# EAGLE design generic_micro_1 (EAGLE 6.4)
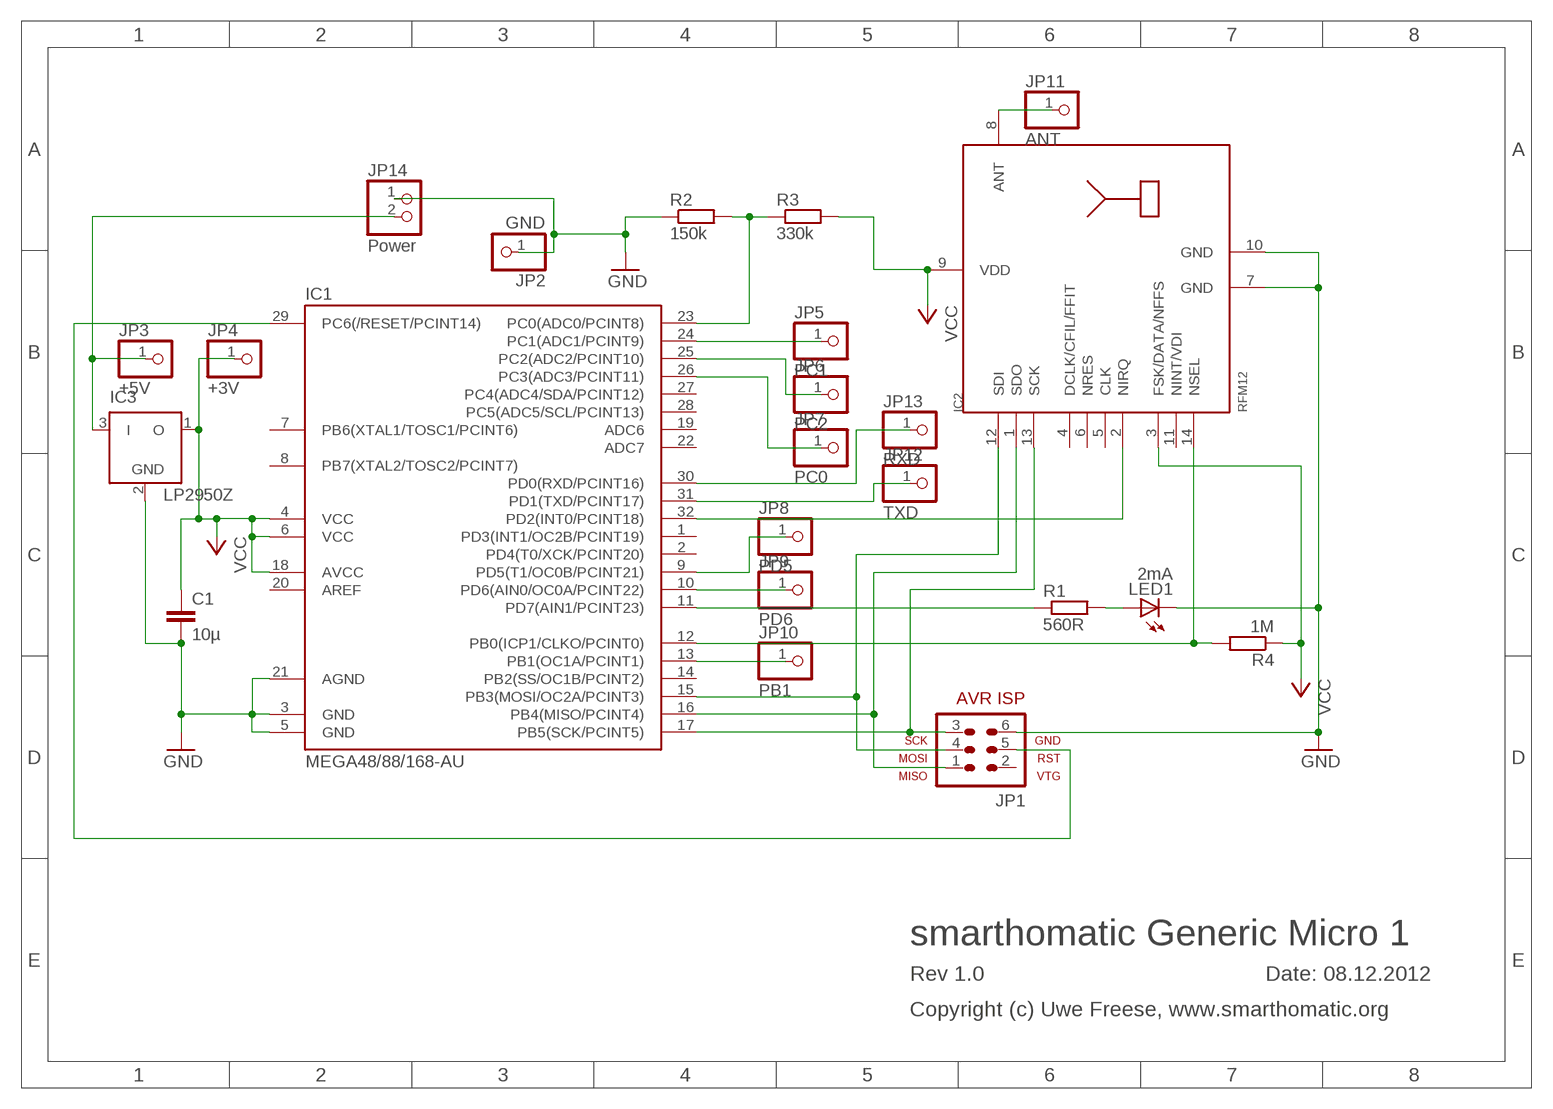
[diagram p0: schematic, sheet 1]

## Parts
C1  10µ  C-EUC0805  [C0805]
IC1  MEGA48/88/168-AU  [TQFP32-08]
IC2  RFM12  [RFM]
IC3  LP2950Z  [TO92]
JP1  AVR-ISP-6  [AVR-ISP-6]
JP2  GND  PINHD-1X1  [1X01]
JP3  +5V  PINHD-1X1  [1X01]
JP4  +3V  PINHD-1X1  [1X01]
JP5  PC1  PINHD-1X1  [1X01]
JP6  PC2  PINHD-1X1  [1X01]
JP7  PC0  PINHD-1X1  [1X01]
JP8  PD5  PINHD-1X1  [1X01]
JP9  PD6  PINHD-1X1  [1X01]
JP10  PB1  PINHD-1X1  [1X01]
JP11  ANT  PINHD-1X1  [1X01]
JP12  TXD  PINHD-1X1  [1X01]
JP13  RXD  PINHD-1X1  [1X01]
JP14  Power  PINHD-1X2  [1X02]
LED1  2mA  LED3MM  [LED3MM]
R1  560R  R-EU_R0603  [R0603]
R2  150k  R-EU_R0603  [R0603]
R3  330k  R-EU_R0603  [R0603]
R4  1M  R-EU_R0603  [R0603]

## Nets
GND: C1.2 IC1.3(GND) IC1.5(GND) IC1.21(AGND) IC2.7(GND) IC2.10(GND) IC3.2(GND) JP1.6 JP2.1 JP14.1 LED1.K(C) R2.1
N$1: IC1.26(PC3(ADC3/PCINT11)) JP7.1
N$2: IC1.24(PC1(ADC1/PCINT9)) JP5.1
N$3: IC1.15(PB3(MOSI/OC2A/PCINT3)) IC2.12(SDI) JP1.4
N$4: IC1.16(PB4(MISO/PCINT4)) IC2.1(SDO) JP1.1
N$5: IC1.17(PB5(SCK/PCINT5)) IC2.13(SCK) JP1.3
N$6: IC1.11(PD7(AIN1/PCINT23)) R1.1
N$7: IC1.25(PC2(ADC2/PCINT10)) JP6.1
N$8: IC1.29(PC6(/RESET/PCINT14)) JP1.5
N$9: IC1.10(PD6(AIN0/OC0A/PCINT22)) JP9.1
N$10: IC1.9(PD5(T1/OC0B/PCINT21)) JP8.1
N$11: IC1.13(PB1(OC1A/PCINT1)) JP10.1
N$12: LED1.A R1.2
N$13: IC1.12(PB0(ICP1/CLKO/PCINT0)) IC2.14(NSEL) R4.2
N$14: IC1.23(PC0(ADC0/PCINT8)) R2.2 R3.1
N$15: IC1.32(PD2(INT0/PCINT18)) IC2.2(NIRQ)
N$16: IC2.8(ANT) JP11.1
N$17: IC3.3(I) JP3.1 JP14.2
N$18: IC1.31(PD1(TXD/PCINT17)) JP12.1
N$19: IC1.30(PD0(RXD/PCINT16)) JP13.1
VCC: C1.1 IC1.4(VCC) IC1.6(VCC) IC1.18(AVCC) IC2.3(FSK/DATA/NFFS) IC2.9(VDD) IC3.1(O) JP4.1 R3.2 R4.1
Unconnected: IC1.1(PD3(INT1/OC2B/PCINT19)) IC1.2(PD4(T0/XCK/PCINT20)) IC1.7(PB6(XTAL1/TOSC1/PCINT6)) IC1.8(PB7(XTAL2/TOSC2/PCINT7)) IC1.14(PB2(SS/OC1B/PCINT2)) IC1.19(ADC6) IC1.20(AREF) IC1.22(ADC7) IC1.27(PC4(ADC4/SDA/PCINT12)) IC1.28(PC5(ADC5/SCL/PCINT13)) IC2.4(DCLK/CFIL/FFIT) IC2.5(CLK) IC2.6(NRES) IC2.11(NINT/VDI) JP1.2

## Notes on the sheet
- smarthomatic Generic Micro 1
- Rev 1.0 | Date: 08.12.2012
- Copyright (c) Uwe Freese, www.smarthomatic.org

## Library data of the parts
C1 = rcl:C-EU: CAPACITOR, European symbol
IC1 = avr-5-4.16:MEGA48/88/168
IC2 = hopeRF:RFM12
IC3 = linear:LP2950: 100 mA, Low Power Low Dropout Voltage Regulator Source: http://www.onsemi.com/pub/Collateral/LP2950-D.PDF
JP1 = avr-5-4.16:AVR-ISP-6: AVR ISP-6 Serial Programming Header
JP2-JP13 = pinhead:PINHD-1X1: PIN HEADER
JP14 = pinhead:PINHD-1X2: PIN HEADER
LED1 = led:LED: LED OSRAM: - CHIPLED LG R971, LG N971, LY N971, LG Q971, LY Q971, LO R971, LY R971 LH N974, LH R974 LS Q976, LO Q976, LY Q976 LO Q996 - Hyper CHIPLED LW Q18S LB Q993, LB Q99A, LB R99A - SideLED LS A670, LO A670, LY A670, LG A670, LP A670 LB A673, LV A673, LT A673, LW A673 LH A674 LY A675 LS A676, LA A676, LO A676, LY A676, LW A676 LS A679, LY A679, LG A679 - Hyper Micro SIDELED® LS Y876, LA Y876, LO Y876, LY Y876 LT Y87S - SmartLED LW L88C, LW L88S LB L89C, LB L89S, LG L890 LS L89K, LO L89K, LY L89K LS L896, LA L896, LO L896, LY L896 - TOPLED LS T670, LO T670, LY T670, LG T670, LP T670 LSG T670, LSP T670, LSY T670, LOP T670, LYG T670 LG T671, LOG T671, LSG T671 LB T673, LV T673, LT T673, LW T673 LH T674 LS T676, LA T676, LO T676, LY T676, LB T676, LH T676, LSB T676, LW T676 LB T67C, LV T67C, LT T67C, LS T67K, LO T67K, LY T67K, LW E67C LS E67B, LA E67B, LO E67B, LY E67B, LB E67C, LV E67C, LT E67C LW T67C LS T679, LY T679, LG T679 LS T770, LO T770, LY T770, LG T770, LP T770 LB T773, LV T773, LT T773, LW T773 LH T774 LS E675, LA E675, LY E675, LS T675 LS T776, LA T776, LO T776, LY T776, LB T776 LHGB T686 LT T68C, LB T68C - Hyper Mini TOPLED® LB M676 - Mini TOPLED Santana® LG M470 LS M47K, LO M47K, LY M47K Source: http://www.osram.convergy.de LUXEON: - LUMILED® LXK2-PW12-R00, LXK2-PW12-S00, LXK2-PW14-U00, LXK2-PW14-V00 LXK2-PM12-R00, LXK2-PM12-S00, LXK2-PM14-U00 LXK2-PE12-Q00, LXK2-PE12-R00, LXK2-PE12-S00, LXK2-PE14-T00, LXK2-PE14-U00 LXK2-PB12-K00, LXK2-PB12-L00, LXK2-PB12-M00, LXK2-PB14-N00, LXK2-PB14-P00, LXK2-PB14-Q00 LXK2-PR12-L00, LXK2-PR12-M00, LXK2-PR14-Q00, LXK2-PR14-R00 LXK2-PD12-Q00, LXK2-PD12-R00, LXK2-PD12-S00 LXK2-PH12-R00, LXK2-PH12-S00 LXK2-PL12-P00, LXK2-PL12-Q00, LXK2-PL12-R00 Source: www.luxeon.com KINGBRIGHT: KA-3528ASYC Source: www.kingbright.com
R1-R4 = rcl:R-EU_: RESISTOR, European symbol

## Board
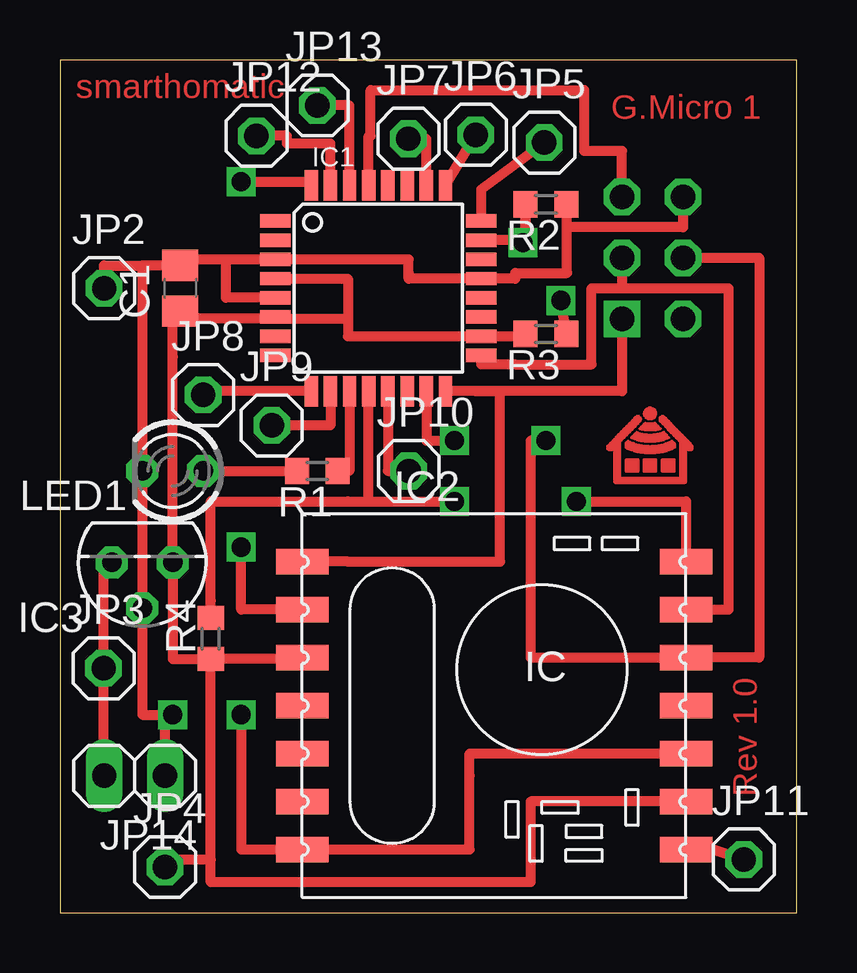
[diagram p1: board, top side]
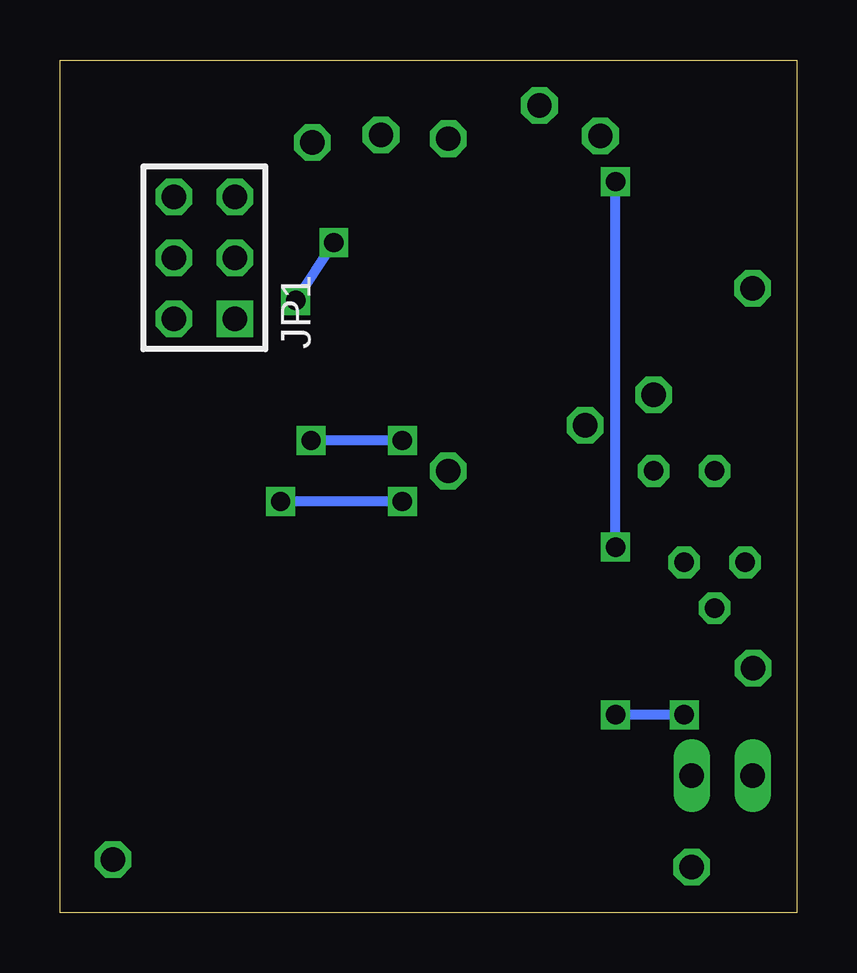
[diagram p2: board, bottom side, seen from below]

Size 30.72 x 35.55 mm. Coordinates in mm from the lower left corner, seen from the top.
Outline: 0,0 30.72,0 30.72,35.55 0,35.55 0,0
Copper layers (1*16): Top 0.035mm / dielectric 1.5mm / Bottom 0.035mm
Design rules "default": minimum track width 10mil, minimum drill 24mil, track to track 8mil, track to pad 8mil, pad to pad 8mil, via to via 8mil, smd to smd 8mil, copper to edge 40mil, drill to drill 8mil, minimum pad ring 10mil, minimum via ring 8mil, stop-mask expansion 4mil, vias tented up to drill 0mil, thermal gap 10mil

### Footprints (pad centres in the part's own frame; a part is rotated, then mirrored left to right if it is on the bottom)
C0805 = smd 1.3 x 1.5: 1 -0.95,0; 2 0.95,0
TQFP32-08 = smd 1.27 x 0.559: 1 -4.293,2.8; 2 -4.293,2; 3 -4.293,1.2; 4 -4.293,0.4; 5 -4.293,-0.4; 6 -4.293,-1.2; 7 -4.293,-2; 8 -4.293,-2.8; 17 4.293,-2.8; 18 4.293,-2; 19 4.293,-1.2; 20 4.293,-0.4; 21 4.293,0.4; 22 4.293,1.2; 23 4.293,2; 24 4.293,2.8 | smd 0.559 x 1.27: 9 -2.8,-4.293; 10 -2,-4.293; 11 -1.2,-4.293; 12 -0.4,-4.293; 13 0.4,-4.293; 14 1.2,-4.293; 15 2,-4.293; 16 2.8,-4.293; 25 2.8,4.293; 26 2,4.293; 27 1.2,4.293; 28 0.4,4.293; 29 -0.4,4.293; 30 -1.2,4.293; 31 -2,4.293; 32 -2.8,4.293
RFM = smd 2.184 x 1.067: 1 0,14; 2 0,12; 3 0,10; 4 0,8; 5 0,6; 6 0,4; 7 0,2; 8 16,2; 9 16,4; 10 16,6; 11 16,8; 12 16,10; 13 16,12; 14 16,14
TO92 = drill 0.813 octagon: 1 -1.27,0; 2 0,1.905; 3 1.27,0
AVR-ISP-6 = drill 1.016 square: 1 -2.54,-1.27 | drill 1.016 octagon: 2 -2.54,1.27; 3 0,-1.27; 4 0,1.27; 5 2.54,-1.27; 6 2.54,1.27
1X01 = drill 1.016 octagon: 1 0,0
1X02 = drill 1.016 long: 1 -1.27,0; 2 1.27,0
LED3MM = drill 0.813 octagon: A -1.27,0; K 1.27,0
R0603 = smd 1 x 1.1: 1 -0.85,0; 2 0.85,0

### Placement (x,y rotation side)
C1  5.02,26.04 90 top
IC1  13.27,26.04 0 top
IC2  10.1,0.64 0 top
IC3  3.43,14.61 180 top
JP1  24.7,27.31 90 bottom
JP2  1.84,26.04 0 top
JP3  1.82,10.19 0 top
JP4  4.38,1.91 0 top
JP5  20.19,32.11 0 top
JP6  17.34,32.43 0 top
JP7  14.53,32.27 0 top
JP8  5.97,21.59 0 top
JP9  8.83,20.32 0 top
JP10  14.54,18.42 0 top
JP11  28.51,2.22 0 top
JP12  8.19,32.39 0 top
JP13  10.73,33.66 0 top
JP14  3.11,5.71 180 top
LED1  4.7,18.42 180 top
R1  10.73,18.42 180 top
R2  20.26,29.53 180 top
R3  20.26,24.13 180 top
R4  6.29,11.43 90 top

### Tracks (layer width: path | path; a pad name or v marks a point on that pad's centre or on a via)
GND  (via drill 0.8)
  Top 0.406: IC2.10 17.08,6.64 17.08,5.71 17.08,2.64 IC2.7 7.56,2.64 v7.56,8.25 | IC3.2 LED1.K 3.43,25.64 3.43,26.99 | IC3.2 3.43,12.07 | 3.43,12.07 3.43,8.25 v4.7,8.25 4.38,8.25 JP14.1 | C1.2 3.43,26.99 | C1.2 4.97,26.99 | 6.92,27.24 IC1.3 14.54,27.24 14.54,26.67 14.54,26.43 IC1.21 18.99,26.43 18.99,26.67 21.15,26.67 21.15,28.57 | 6.92,27.24 5.02,27.24 C1.2 | IC1.5 6.92,25.64 6.92,27.24 | R2.1 21.15,29.53 21.15,28.57 | IC3.2 3.43,12.07 | JP1.6 25.97,28.57 21.15,28.57 | JP2.1 1.84,26.99 3.43,26.99
  Bottom 0.406: v4.7,8.25 v7.56,8.25
N$1
  Top 0.406: IC1.26 15.27,32.27 JP7.1
N$2
  Top 0.406: IC1.24 17.56,30.16 JP5.1
N$3  (via drill 0.8)
  Top 0.406: IC1.15 15.27,19.68 v16.45,19.68 | v20.26,19.68 19.62,19.68 19.62,18.42 19.62,10.64 IC2.12 29.15,10.64 29.15,27.31 JP1.4
  Bottom 0.406: v16.45,19.68 v20.26,19.68
N$4
  Top 0.406: 18.35,21.74 17.34,21.74 | 17.34,21.74 18.35,21.74 | 18.35,21.74 IC1.16 | IC2.1 12,14.64 18.35,14.64 18.35,21.74 | 17.34,21.74 18.35,21.74 | JP1.1 23.43,21.74 18.35,21.74
N$5
  Top 0.406: IC2.13 27.88,12.64 27.88,26.04 23.43,26.04 | IC1.17 17.56,22.86 18.99,22.86 22.16,22.86 22.16,26.04 23.43,26.04 | JP1.3 23.43,26.04
N$6
  Top 0.406: IC1.11 12.07,18.42 R1.1
N$7
  Top 0.406: IC1.25 JP6.1
N$8
  Top 0.406: IC1.29 12.87,32.39 12.95,32.39 12.95,34.29 21.84,34.29 21.84,31.75 23.43,31.75 JP1.5
N$9
  Top 0.406: IC1.10 11.27,20.32 JP9.1
N$10
  Top 0.406: IC1.9 5.97,21.74 JP8.1
N$11
  Top 0.406: IC1.13 13.67,18.42 JP10.1
N$12
  Top 0.406: LED1.A R1.2
N$13  (via drill 0.8)
  Top 0.406: R4.2 6.29,13.02 6.29,17.14 12,17.14 12.87,17.14 | 12.87,17.14 IC1.12 | 12.87,17.14 v16.45,17.14 | v21.53,17.14 26.1,17.14 IC2.14
  Bottom 0.406: v16.45,17.14 v21.53,17.14
N$14  (via drill 0.8)
  Top 0.406: 19.41,28.57 R2.2 19.41,28.57 | 19.41,28.57 19.41,28.04 IC1.23 | R3.1 v20.89,25.53 | v19.3,27.94 19.41,28.57
  Bottom 0.406: v20.89,25.53 v19.3,27.94
N$15  (via drill 0.8)
  Top 0.406: 10.47,30.48 IC1.32 10.47,30.48 | IC2.2 7.56,12.64 v7.56,15.24 | v7.56,30.48 10.47,30.48
  Bottom 0.406: v7.56,15.24 v7.56,30.48
N$16
  Top 0.406: IC2.8 27.24,2.64 JP11.1
N$17
  Top 0.406: IC3.3 1.82,14.61 JP3.1 1.82,5.73 arc90 JP14.2
N$18
  Top 0.406: IC1.31 11.27,32.07 9.46,32.07 9.46,32.39 JP12.1
N$19
  Top 0.406: IC1.30 12.07,33.66 JP13.1
VCC
  Top 0.406: IC1.6 8.98,24.76 | IC1.6 8.98,24.76 | 8.98,24.76 12,24.76 | 12,24.76 12,24.04 IC1.18 19.31,24.04 arc90 R3.2 | IC1.4 12,26.43 12,24.76 | IC2.9 19.62,4.64 19.62,1.27 6.29,1.27 6.29,2.22 | 6.29,2.22 R4.1 | IC2.3 9.46,10.58 R4.1 | IC1.6 arc-90 8.91,24.76 6.92,24.76 5.02,24.76 C1.1 4.7,25.08 4.7,23.18 IC3.1 4.7,14.32 4.7,10.79 4.7,10.58 R4.1 | 6.29,2.22 5.33,2.22 4.38,2.22 JP4.1
(copper drawn outside any net)
  shapes: Top area x379

### Text on the board
Top: smarthomatic | G.Micro 1 | Rev 1.0